# EAGLE design working (EAGLE 6.3)
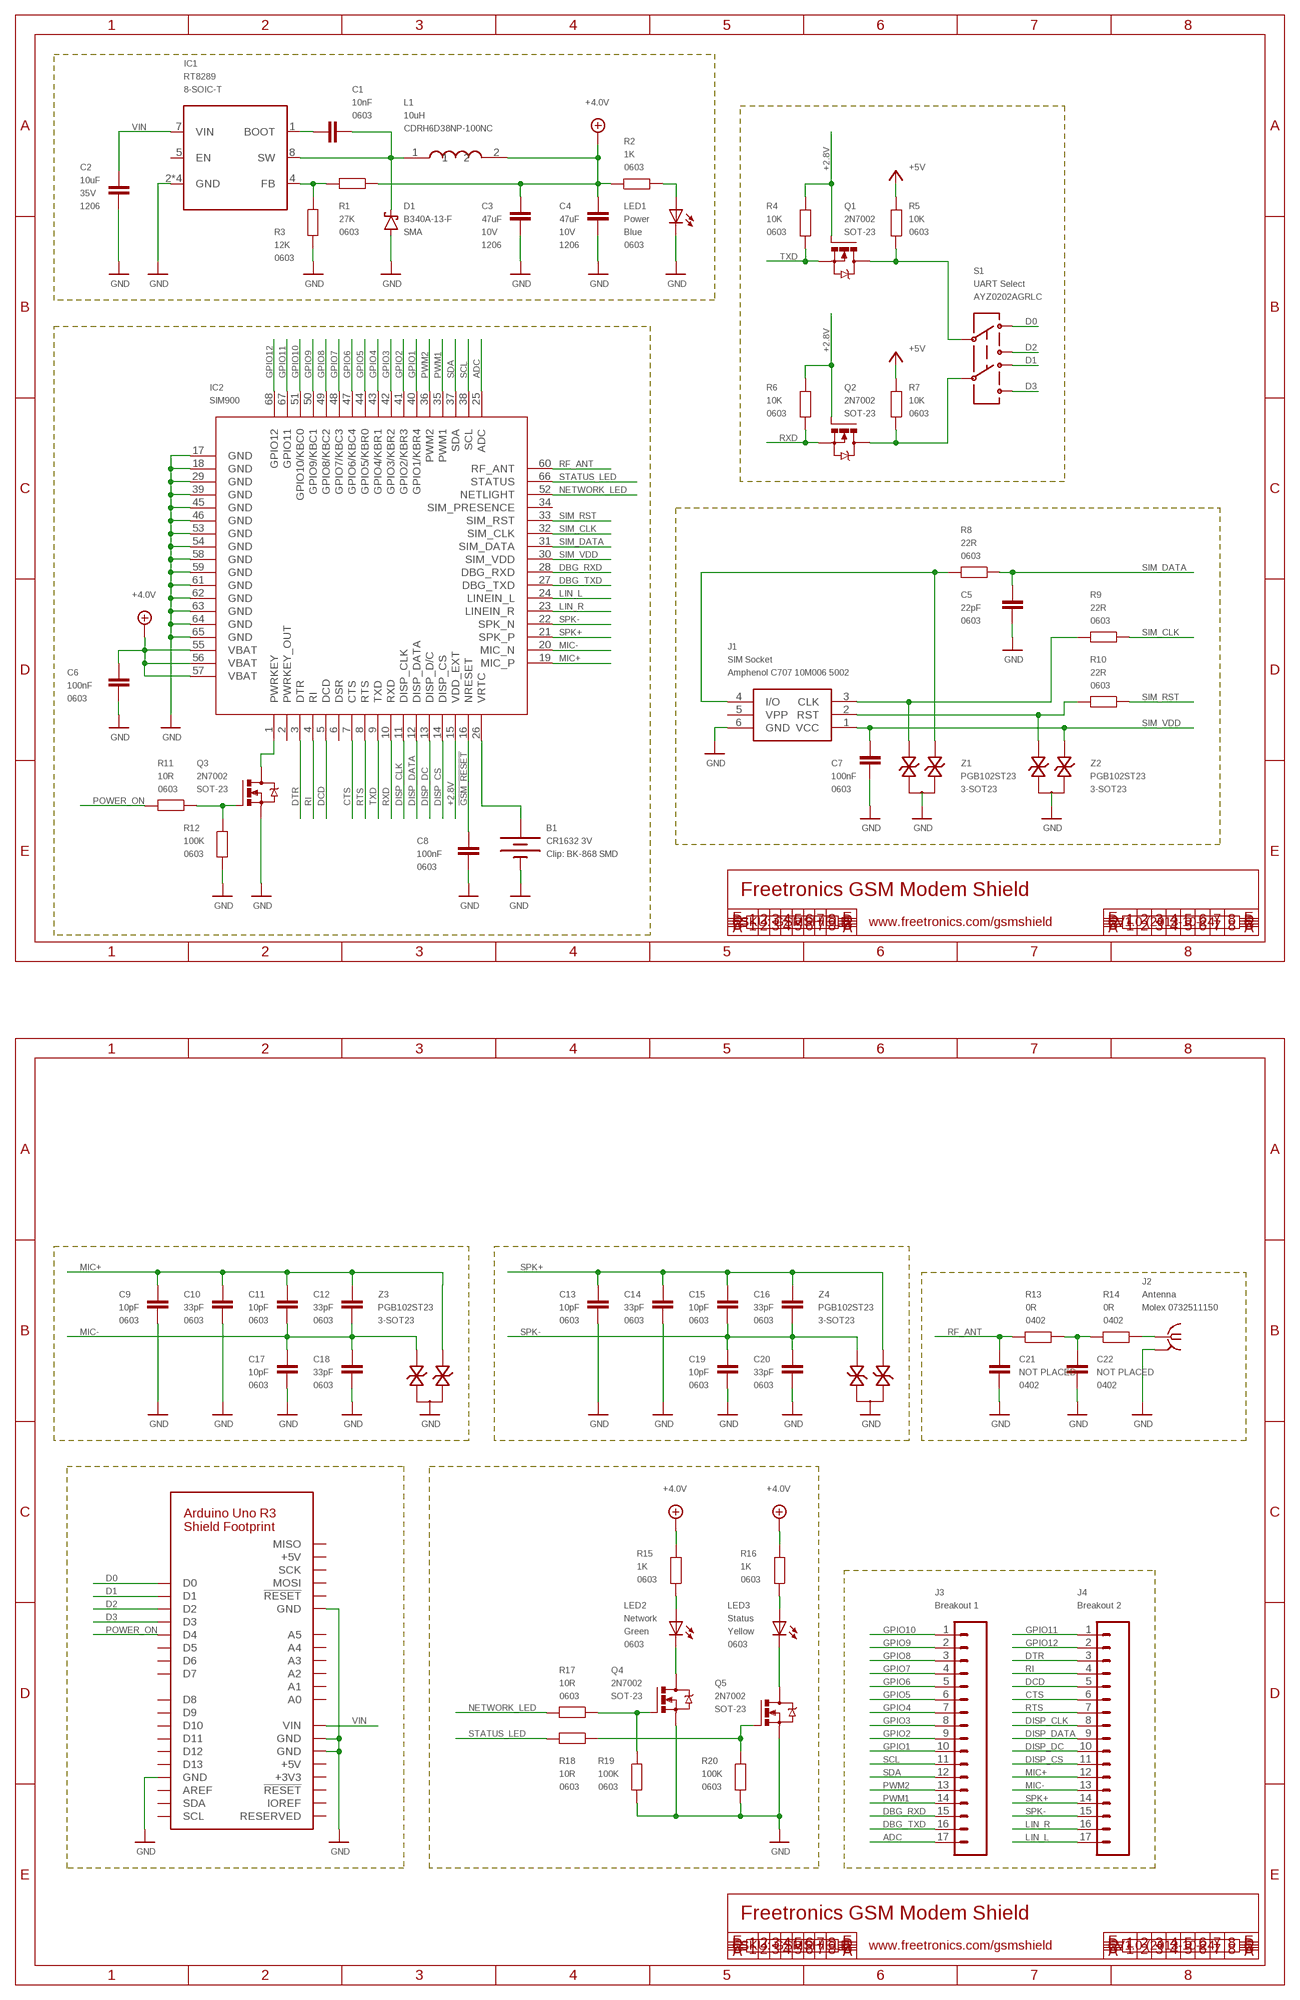
[diagram p0: schematic, sheet 1]

## Parts
B1  CR1632 3V  BATTERY  [BATCON_16MM]
C1  10nF  CAP0603  [0603]
C2  10uF  C-EUC1206  [C1206]
C3  47uF  C-EUC1206  [C1206]
C4  47uF  C-EUC1206  [C1206]
C5  22pF  CAP0603  [0603]
C6  100nF  CAP0603  [0603]
C7  100nF  CAP0603  [0603]
C8  100nF  CAP0603  [0603]
C9  10pF  CAP0603  [0603]
C10  33pF  CAP0603  [0603]
C11  10pF  CAP0603  [0603]
C12  33pF  CAP0603  [0603]
C13  10pF  CAP0603  [0603]
C14  33pF  CAP0603  [0603]
C15  10pF  CAP0603  [0603]
C16  33pF  CAP0603  [0603]
C17  10pF  CAP0603  [0603]
C18  33pF  CAP0603  [0603]
C19  10pF  CAP0603  [0603]
C20  33pF  CAP0603  [0603]
C21  NOT PLACED  CAP0402  [C0402]
C22  NOT PLACED  CAP0402  [C0402]
D1  B340A-13-F  SCHOTTKY-SMA  [SMA]
IC1  RT8289  [SO08T]
IC2  SIM900  [SIM900]
J1  SIM Socket  SIMHOLDER3  [SIMHOLDER3]
J2  Antenna  SMA-142-0701-881/886  [J502-ND-142-0701-881/886]
J3  Breakout 1  M17  [1X17]
J4  Breakout 2  M17  [1X17]
J5  ARDUINO-SHIELD_R3  [ARDUINO-SHIELD_R3]
L1  10uH  CDRH6D38SMT  [CDRH]
LED1  Power  LED0603  [LED-0603]
LED2  Network  LED0603  [LED-0603]
LED3  Status  LED0603  [LED-0603]
Q1  2N7002  [SOT23-3]
Q2  2N7002  [SOT23-3]
Q3  2N7002  [SOT23-3]
Q4  2N7002  [SOT23-3]
Q5  2N7002  [SOT23-3]
R1  27K  RESISTOR0603  [0603]
R2  1K  RESISTOR0603  [0603]
R3  12K  RESISTOR0603  [0603]
R4  10K  RESISTOR0603  [0603]
R5  10K  RESISTOR0603  [0603]
R6  10K  RESISTOR0603  [0603]
R7  10K  RESISTOR0603  [0603]
R8  22R  RESISTOR0603  [0603]
R9  22R  RESISTOR0603  [0603]
R10  22R  RESISTOR0603  [0603]
R11  10R  RESISTOR0603  [0603]
R12  100K  RESISTOR0603  [0603]
R13  0R  RESISTOR0402  [C0402]
R14  0R  RESISTOR0402  [C0402]
R15  1K  RESISTOR0603  [0603]
R16  1K  RESISTOR0603  [0603]
R17  10R  RESISTOR0603  [0603]
R18  10R  RESISTOR0603  [0603]
R19  100K  RESISTOR0603  [0603]
R20  100K  RESISTOR0603  [0603]
S1  UART Select  SWITCH-DPDTSMD  [AYZ0202]
Z1  PGB102ST23  [SOT23-3]
Z2  PGB102ST23  [SOT23-3]
Z3  PGB102ST23  [SOT23-3]
Z4  PGB102ST23  [SOT23-3]

## Nets
!GSM_RESET: C8.2 IC2.16(NRESET)
+2.8V: IC2.15(VDD_EXT) Q1.1(G) Q2.1(G) R4.1 R6.1
+4.0V: C3.1 C4.1 C6.2 IC2.55(VBAT) IC2.56(VBAT) IC2.57(VBAT) L1.2 R1.1 R2.1 R15.1 R16.1
+5V: R5.1 R7.1
ADC: IC2.25(ADC) J3.17
CTS: IC2.7(CTS) J4.6
D0: J5.D0 S1.1
D1: J5.D1 S1.4
D2: J5.D2 S1.3
D3: J5.D3 S1.6
DBG_RXD: IC2.28(DBG_RXD) J3.15
DBG_TXD: IC2.27(DBG_TXD) J3.16
DCD: IC2.5(DCD) J4.5
DISP_CLK: IC2.11(DISP_CLK) J4.8
DISP_CS: IC2.14(DISP_CS) J4.11
DISP_DATA: IC2.12(DISP_DATA) J4.9
DISP_DC: IC2.13(DISP_D/C) J4.10
DTR: IC2.3(DTR) J4.3
GND: B1.GND(-) C2.2 C3.2 C4.2 C5.1 C6.1 C7.1 C8.1 C9.1 C10.1 C13.1 C14.1 C17.1 C18.1 C19.1 C20.1 C21.1 C22.1 D1.A IC1.2(GND) IC1.3(GND) IC1.6(GND) IC1.PAD(GND) IC2.17(GND) IC2.18(GND) IC2.29(GND) IC2.39(GND) IC2.45(GND) IC2.46(GND) IC2.53(GND) IC2.54(GND) IC2.58(GND) IC2.59(GND) IC2.61(GND) IC2.62(GND) IC2.63(GND) IC2.64(GND) IC2.65(GND) J1.6(GND) J2.G@1(GND) J5.GND J5.GND@0(GND) J5.GND@1(GND) J5.GND@2(GND) LED1.C Q3.2(S) Q4.2(S) Q5.2(S) R3.1 R12.1 R19.1 R20.1 Z1.3 Z2.3 Z3.3 Z4.3
GPIO1: IC2.40(GPIO1/KBR4) J3.10
GPIO2: IC2.41(GPIO2/KBR3) J3.9
GPIO3: IC2.42(GPIO3/KBR2) J3.8
GPIO4: IC2.43(GPIO4/KBR1) J3.7
GPIO5: IC2.44(GPIO5/KBR0) J3.6
GPIO6: IC2.47(GPIO6/KBC4) J3.5
GPIO7: IC2.48(GPIO7/KBC3) J3.4
GPIO8: IC2.49(GPIO8/KBC2) J3.3
GPIO9: IC2.50(GPIO9/KBC1) J3.2
GPIO10: IC2.51(GPIO10/KBC0) J3.1
GPIO11: IC2.67(GPIO11) J4.1
GPIO12: IC2.68(GPIO12) J4.2
LIN_L: IC2.24(LINEIN_L) J4.17
LIN_R: IC2.23(LINEIN_R) J4.16
MIC+: C9.2 C10.2 C11.2 C12.2 IC2.19(MIC_P) J4.12 Z3.2
MIC-: C11.1 C12.1 C17.2 C18.2 IC2.20(MIC_N) J4.13 Z3.1
N$1: LED1.A R2.2
N$2: LED2.C Q4.3(D)
N$3: LED3.C Q5.3(D)
N$4: Q4.1(G) R17.1 R19.2
N$5: Q5.1(G) R18.1 R20.2
N$6: B1.PWR@1(+) IC2.26(VRTC)
N$22: J1.2(RST) R10.2 Z2.1
N$40: J1.3(CLK) R9.2 Z1.1
N$49: J1.4(I/O) R8.2 Z1.2
N$67: IC2.1(PWRKEY) Q3.3(D)
N$69: Q3.1(G) R11.1 R12.2
N$70: C22.2 R13.2 R14.1
N$71: J2.1 R14.2
N$76: LED3.A R16.2
N$77: LED2.A R15.2
N$143: C1.1 D1.K IC1.8(SW) L1.1
N$144: IC1.4(FB) R1.2 R3.2
N$145: C1.2 IC1.1(BOOT)
NETWORK_LED: IC2.52(NETLIGHT) R17.2
POWER_ON: J5.D4 R11.2
PWM1: IC2.35(PWM1) J3.14
PWM2: IC2.36(PWM2) J3.13
RF_ANT: C21.2 IC2.60(RF_ANT) R13.1
RI: IC2.4(RI) J4.4
RTS: IC2.8(RTS) J4.7
RXD: IC2.10(RXD) Q2.2(S) R6.2
RXD_5V: Q2.3(D) R7.2 S1.5
SCL: IC2.38(SCL) J3.11
SDA: IC2.37(SDA) J3.12
SIM_CLK: IC2.32(SIM_CLK) R9.1
SIM_DATA: C5.2 IC2.31(SIM_DATA) R8.1
SIM_RST: IC2.33(SIM_RST) R10.1
SIM_VDD: C7.2 IC2.30(SIM_VDD) J1.1(VCC) Z2.2
SPK+: C13.2 C14.2 C15.2 C16.2 IC2.21(SPK_P) J4.14 Z4.1
SPK-: C15.1 C16.1 C19.2 C20.2 IC2.22(SPK_N) J4.15 Z4.2
STATUS_LED: IC2.66(STATUS) R18.2
TXD: IC2.9(TXD) Q1.2(S) R4.2
TXD_5V: Q1.3(D) R5.2 S1.2
VIN: C2.1 IC1.7(VIN) J5.VIN
Unconnected: IC1.5(EN) IC2.2(PWRKEY_OUT) IC2.6(DSR) IC2.34(SIM_PRESENCE) J1.5(VPP) J5.!RESET J5.!RESET@0(!RESET) J5.+5V@0(+5V) J5.A0 J5.A1 J5.A2 J5.A3 J5.A4 J5.A5 J5.AREF J5.D5 J5.D6 J5.D7 J5.D8 J5.D9 J5.D10 J5.D11 J5.D12 J5.D13 J5.IOREF J5.MISO J5.MOSI J5.RESERVED J5.SCK J5.SCL J5.SDA

## Notes on the sheet
- Freetronics GSM Modem Shield
- SKU: GSMSHIELD | www.freetronics.com/gsmshield | V1.0 (2013-10-24)
- Freetronics GSM Modem Shield
- SKU: GSMSHIELD | www.freetronics.com/gsmshield | V1.0 (2013-10-24)

## Power pins joined to a net without a drawn wire
+3V3: J5.3V3(+3V3)
+5V: J5.+5V
GND: J2.G@2(GND) J2.G@3(GND) J2.G@4(GND)

## Library data of the parts
B1 = freetronics-master-v1:BATTERY: Battery Holders Various common sizes : AA, AAA, 20mm coin cell and 12mm coin cell.; FOO: Clip: BK-868 SMD
C1 C5-C20 = freetronics-master-v1:CAP: Capacitor Standard 0603 ceramic capacitor, and 0.1" leaded capacitor.; PACKAGE: 0603
C2 = rcl:C-EU: CAPACITOR, European symbol; PACKAGE: 1206; VOLTAGE: 35V
C3 C4 = rcl:C-EU: CAPACITOR, European symbol; PACKAGE: 1206; VOLTAGE: 10V
C21 C22 = freetronics-master-v1:CAP: Capacitor Standard 0603 ceramic capacitor, and 0.1" leaded capacitor.; PACKAGE: 0402
D1 = freetronics-luke:SCHOTTKY: Schottky diode; PACKAGE: SMA
IC1 = freetronics-luke:RT8289: RT8289 buck regulator; PACKAGE: 8-SOIC-T
IC2 = ICs_v54:SIM900
J1 = SparkFun2:SIMHOLDER3; ID: Amphenol C707 10M006 5002
J2 = con-coax:SMA-: SMA 50 Ohm End Launch Jack Receptacle - Round Contact Johnson Components Source: www.johnsoncomponents.com .. J502-ND.pdf; ID: Molex 0732511150; MF: JOHNSON COMPONENTS; MPN: 142-0701-881; OC_FARNELL: 1608603; OC_NEWARK: 08B906
J3 J4 = freetronics-master-v1:M17
J5 = freetronics-luke:ARDUINO-SHIELD_R3: Arduino Uno/Eleven/Leonardo shield, R3 compatible.
L1 = freetronics-jon:CDRH6D38: Inductor; ID: CDRH6D38NP-100NC
LED1 = freetronics-master-v1:LED: LEDs Standard schematic elements and footprints for 5mm, 3mm, 1206, and 0603 sized LEDs. 5mm - Spark Fun Electronics SKU : COM-00529 (and others); COLOR: Blue; PACKAGE: 0603
LED2 = freetronics-master-v1:LED: LEDs Standard schematic elements and footprints for 5mm, 3mm, 1206, and 0603 sized LEDs. 5mm - Spark Fun Electronics SKU : COM-00529 (and others); COLOR: Green; PACKAGE: 0603
LED3 = freetronics-master-v1:LED: LEDs Standard schematic elements and footprints for 5mm, 3mm, 1206, and 0603 sized LEDs. 5mm - Spark Fun Electronics SKU : COM-00529 (and others); COLOR: Yellow; PACKAGE: 0603
Q1-Q5 = freetronics-luke:2N7002: 2N7002 N-ch MOSFET in SOT-23.; PACKAGE: SOT-23
R1-R12 R15-R20 = freetronics-master-v1:RESISTOR: Resistor Basic schematic elements and footprints for 0603, 1206, and PTH 1/10th watt (small) resistors.; PACKAGE: 0603
R13 R14 = freetronics-master-v1:RESISTOR: Resistor Basic schematic elements and footprints for 0603, 1206, and PTH 1/10th watt (small) resistors.; PACKAGE: 0402
S1 = freetronics-master-v1:SWITCH-DPDT: DPDT Version of the COM-00597; ID: AYZ0202AGRLC
Z1-Z4 = freetronics-luke:PGB102ST23: Littelfuse PGB1 ESD transient suppressor in dual SOT-23 package. http://www.littelfuse.com/data/en/Data_Sheets/Littelfuse_PulseGuard-ESD_PGB1.pdf; PACKAGE: 3-SOT23

## Board
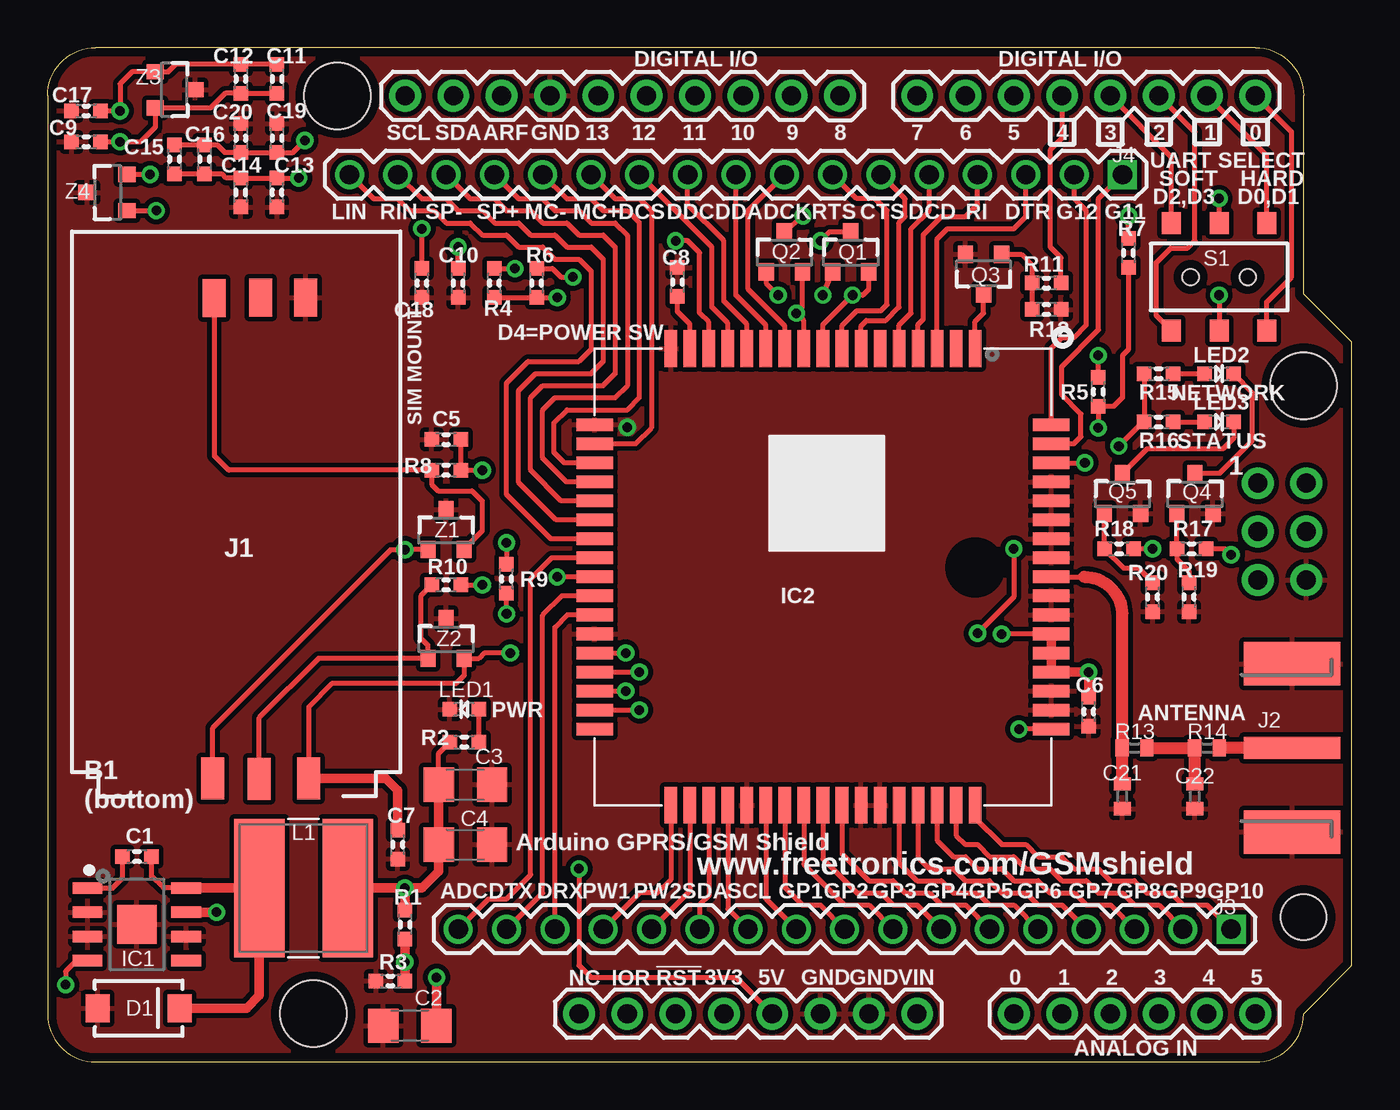
[diagram p1: board, top side]
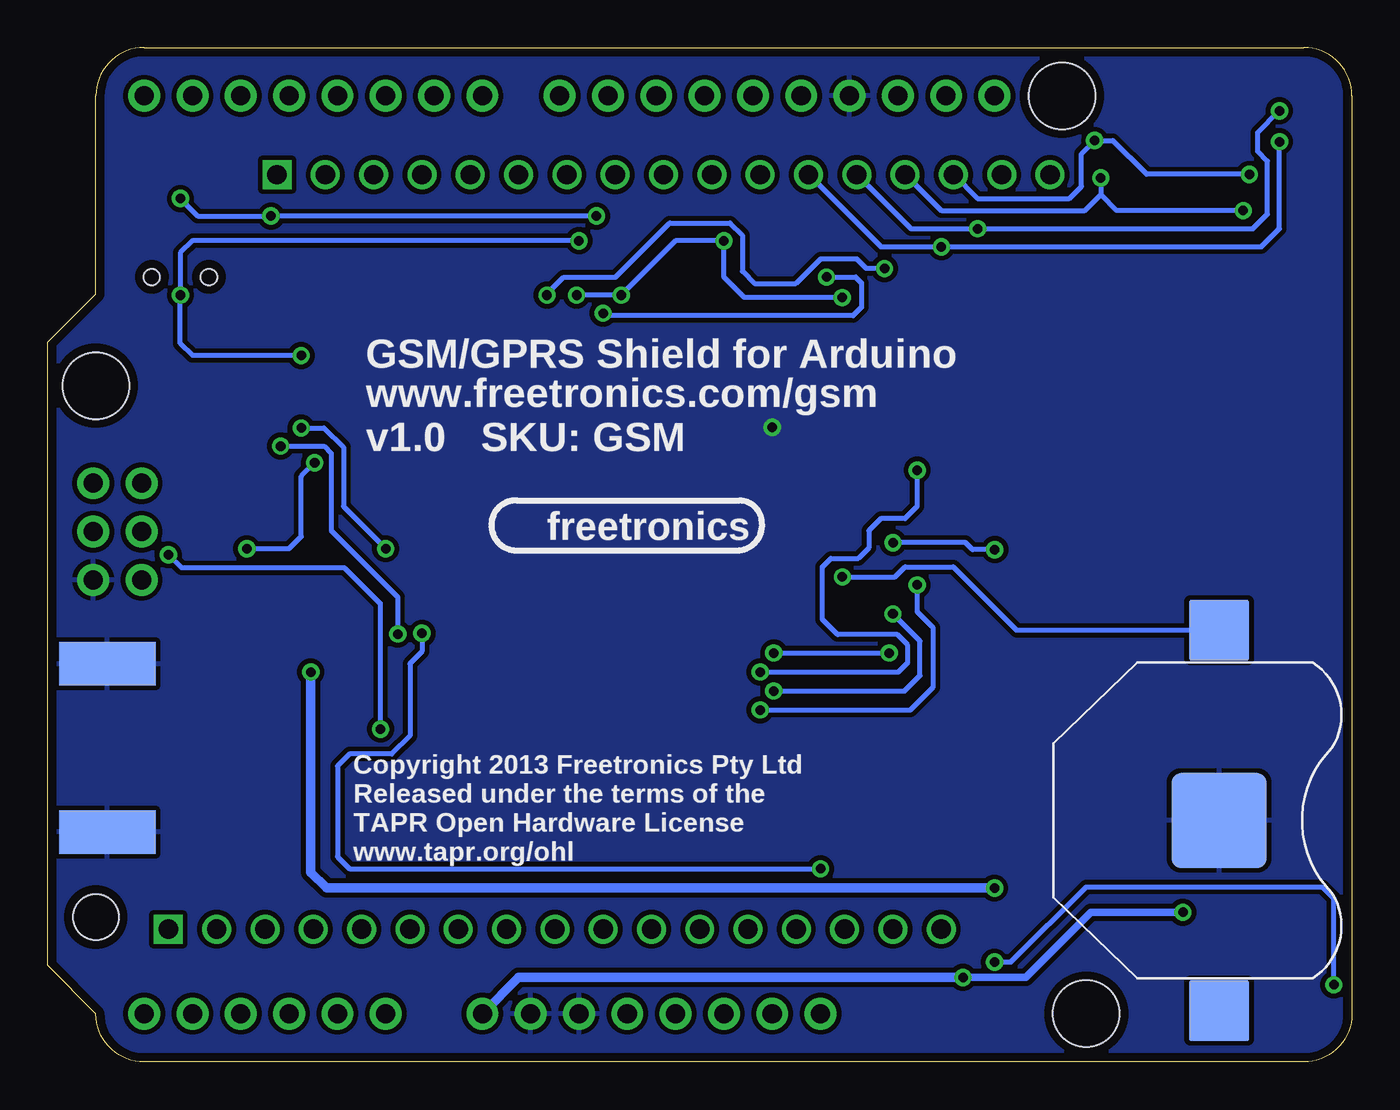
[diagram p2: board, bottom side, seen from below]

Size 68.58 x 53.34 mm. Coordinates in mm from the lower left corner, seen from the top.
Copper layers (1*16): Top 0.0356mm / dielectric 1.5011mm / Bottom 0.0356mm
Design rules "LaenPCBOrder *": minimum track width 10mil, minimum drill 18mil, track to track 10mil, track to pad 10mil, pad to pad 10mil, via to via 10mil, smd to smd 8mil, copper to edge 18mil, drill to drill 8mil, minimum pad ring 10mil, minimum via ring 8mil, stop-mask expansion 4mil, vias tented up to drill 25mil, thermal gap 10mil

### Footprints (pad centres in the part's own frame; a part is rotated, then mirrored left to right if it is on the bottom)
BATCON_16MM = smd 5 x 5: GND 0,0 | smd 3.175 x 3.175: PWR@1 -10,0; PWR@2 10,0
0603 = smd 0.762 x 0.762: 1 -0.762,0; 2 0.762,0
C1206 = smd 1.6 x 1.8: 1 -1.4,0; 2 1.4,0
C0402 = smd 0.7 x 0.9: 1 -0.65,0; 2 0.65,0
SMA = smd 1.27 x 1.47: A -2.15,0; K 2.15,0
SO08T = smd 0.6 x 1.575: 1 -1.905,-2.6; 2 -0.635,-2.6; 3 0.635,-2.6; 4 1.905,-2.6; 5 1.905,2.6; 6 0.635,2.6; 7 -0.635,2.6; 8 -1.905,2.6 | smd 2.057 x 2.057: PAD 0,0
SIM900 = smd 1.93 x 0.66: 1 -12,8; 2 -12,7; 3 -12,6; 4 -12,5; 5 -12,4; 6 -12,3; 7 -12,2; 8 -12,1; 9 -12,0; 10 -12,-1; 11 -12,-2; 12 -12,-3; 13 -12,-4; 14 -12,-5; 15 -12,-6; 16 -12,-7; 17 -12,-8; 35 12,-8; 36 12,-7; 37 12,-6; 38 12,-5; 39 12,-4; 40 12,-3; 41 12,-2; 42 12,-1; 43 12,0; 44 12,1; 45 12,2; 46 12,3; 47 12,4; 48 12,5; 49 12,6; 50 12,7; 51 12,8 | smd 0.66 x 1.93: 18 -8,-12; 19 -7,-12; 20 -6,-12; 21 -5,-12; 22 -4,-12; 23 -3,-12; 24 -2,-12; 25 -1,-12; 26 0,-12; 27 1,-12; 28 2,-12; 29 3,-12; 30 4,-12; 31 5,-12; 32 6,-12; 33 7,-12; 34 8,-12; 52 8,12; 53 7,12; 54 6,12; 55 5,12; 56 4,12; 57 3,12; 58 2,12; 59 1,12; 60 0,12; 61 -1,12; 62 -2,12; 63 -3,12; 64 -4,12; 65 -5,12; 66 -6,12; 67 -7,12; 68 -8,12
SIMHOLDER3 = smd 2.2 x 1.2: 1 0.95,4.81; 2 0.91,7.41; 3 0.95,9.86 | smd 2 x 1.2: 4 26.2,9.78; 5 26.22,7.34; 6 26.22,4.98
J502-ND-142-0701-881/886 = smd 5.08 x 1.143: 1 2.565,0 | smd 5.08 x 2.286: G@1 2.565,4.42; G@2 2.565,-4.42 | smd 5.08 x 2.286 bottom: G@3 2.565,4.42; G@4 2.565,-4.42
1X17 = drill 1.016 square: 1 0,0 | drill 1.016: 2 2.54,0; 3 5.08,0; 4 7.62,0; 5 10.16,0; 6 12.7,0; 7 15.24,0; 8 17.78,0; 9 20.32,0; 10 22.86,0; 11 25.4,0; 12 27.94,0; 13 30.48,0; 14 33.02,0; 15 35.56,0; 16 38.1,0; 17 40.64,0
ARDUINO-SHIELD_R3 = drill 1 pad 1.676: 3V3 0,-24.13; !RESET -2.54,-24.13; !RESET@0 28.08,-1.32; +5V 2.54,-24.13; +5V@0 30.62,3.76; A0 15.24,-24.13; A1 17.78,-24.13; A2 20.32,-24.13; A3 22.86,-24.13; A4 25.4,-24.13; A5 27.94,-24.13; AREF -11.684,24.13; D0 27.94,24.13; D1 25.4,24.13; D2 22.86,24.13; D3 20.32,24.13; D4 17.78,24.13; D5 15.24,24.13; D6 12.7,24.13; D7 10.16,24.13; D8 6.096,24.13; D9 3.556,24.13; D10 1.016,24.13; D11 -1.524,24.13; D12 -4.064,24.13; D13 -6.604,24.13; GND 7.62,-24.13; GND@0 5.08,-24.13; GND@1 -9.144,24.13; GND@2 30.62,-1.32; IOREF -5.08,-24.13; MISO 28.08,3.76; MOSI 30.62,1.22; RESERVED -7.62,-24.13; SCK 28.08,1.22; SCL -16.764,24.13; SDA -14.224,24.13; VIN 10.16,-24.13 | hole 3.5: 30.48,8.89; -20.32,24.13; -21.59,-24.13 | hole 2.4: 30.48,-19.05
CDRH = smd 7.3 x 2.65: 1 0,2.325; 2 0,-2.325
LED-0603 = smd 0.762 x 0.762: A -0.762,0; C 0.762,0
SOT23-3 = smd 0.8 x 0.9: 1 -0.95,-1; 2 0.95,-1; 3 0,1.1
AYZ0202 = smd 1 x 1.15: 1 -2.5,2.825; 2 0,2.825; 3 2.5,2.825; 4 -2.5,-2.825; 5 0,-2.825; 6 2.5,-2.825 | hole 0.85: 1.5,0; -1.5,0

### Placement (x,y rotation side)
B1  6.99,12.7 270 bottom
C1  4.7,10.8 180 top
C2  19.05,1.91 180 top
C3  21.97,14.59 0 top
C4  21.97,11.43 0 top
C5  20.96,32.73 0 top
C6  54.74,18.42 90 top
C7  18.42,11.43 90 top
C8  33.11,41.01 270 top
C9  2.03,48.39 0 top
C10  21.59,40.96 90 top
C11  12.07,51.69 270 top
C12  10.16,51.69 270 top
C13  12.07,45.72 90 top
C14  10.16,45.72 90 top
C15  6.67,47.47 270 top
C16  8.26,47.47 270 top
C17  2.03,50.01 0 top
C18  19.69,40.96 90 top
C19  12.07,48.58 270 top
C20  10.16,48.58 270 top
C21  56.5,13.97 90 top
C22  60.31,13.97 90 top
D1  4.79,2.83 0 top
IC1  4.7,7.24 270 top
IC2  40.77,25.5 270 top
J1  18.54,13.97 90 top
J2  62.87,16.51 0 top
J3  62.23,6.99 180 top
J4  56.52,46.66 180 top
J5  35.56,26.67 0 top
L1  13.46,9.14 90 top
LED1  21.91,18.54 180 top
LED2  61.59,36.2 0 top
LED3  61.59,33.66 0 top
Q1  42.23,42.55 0 top
Q2  38.73,42.55 0 top
Q3  49.21,41.47 180 top
Q4  60.33,29.85 0 top
Q5  56.52,29.85 0 top
R1  18.79,7.23 270 top
R2  21.91,16.83 0 top
R3  18.03,4.26 0 top
R4  23.5,40.96 90 top
R5  55.25,35.24 90 top
R6  25.72,40.96 90 top
R7  56.83,42.55 90 top
R8  20.96,31.12 180 top
R9  24.13,25.4 90 top
R10  20.96,25.08 180 top
R11  52.51,40.96 0 top
R12  52.51,39.56 180 top
R13  57.15,16.51 0 top
R14  60.96,16.51 0 top
R15  58.42,36.2 0 top
R16  58.42,33.66 0 top
R17  60.14,26.99 0 top
R18  56.33,26.99 0 top
R19  60.01,24.45 90 top
R20  58.1,24.45 90 top
S1  61.59,41.27 180 top
Z1  20.96,27.94 0 top
Z2  20.96,22.23 0 top
Z3  6.67,51.12 270 top
Z4  3.18,45.72 90 top

### Tracks (layer width: path | path; a pad name or v marks a point on that pad's centre or on a via)
!GSM_RESET
  Top 0.254: IC2.16 33.77,38.81 33.11,39.46 C8.2
+2.8V  (via drill 0.5)
  Top 0.254: IC2.15 34.77,38.89 34.29,39.37 34.29,42.55 33.66,43.18 v33.02,43.18 | Q2.1 37.79,40.96 v38.42,40.32 | v40.77,40.32 Q1.1 | R4.1 R6.1 v26.8,40.2
  Bottom 0.254: v40.77,40.32 v38.42,40.32 35.56,43.18 v33.02,43.18 33.02,41.27 31.94,40.2 v26.8,40.2
+4.0V  (via drill 0.5)
  Top 0.254: R2.1 21.15,16.8 20.57,16.23 C3.1 | R15.1 R16.1 57.59,33.66 v56.32,32.39 | IC2.57 v50.16,22.51
  Top 0.508: IC2.57 IC2.56 IC2.55 v54.74,20.51 C6.2 | L1.2 v18.79,9.14 | v18.79,9.14 19.69,9.14 20.57,10.03 C4.1 C3.1 | v18.79,9.14 R1.1
  Bottom 0.254: v56.32,32.39 54.04,32.39 53.66,32 53.66,27.94 50.16,24.45 v50.16,22.51
  Bottom 0.508: v18.79,9.14 53.91,9.14 54.74,9.97 v54.74,20.51
+5V  (via drill 0.5)
  Top 0.254: v50.8,26.99 50.8,24.45 v48.9,22.54 | v27.94,10.16 27.94,5.08 28.58,4.45 36.2,4.45 J5.+5V | v55.25,33.34 R5.1 56.07,34.48 56.52,34.93 56.52,37.15 56.83,37.47 R7.1
  Bottom 0.254: v55.25,33.34 54.04,33.34 53.02,32.32 53.02,29.21 v50.8,26.99 | v27.94,10.16 52.71,10.16 53.34,10.8 53.34,15.56 52.71,16.19 50.48,16.19 49.53,17.15 49.53,20.96 48.9,21.59 v48.9,22.54
ADC
  Top 0.254: J3.17 23.18,8.57 24.13,8.57 25.4,9.84 25.4,25.4 26.51,26.51 IC2.25
CTS
  Top 0.254: J4.6 45.09,45.39 45.09,44.45 44.77,44.13 44.77,39.69 44.07,38.99 43.05,38.99 42.77,38.7 IC2.7
D0
  Top 0.254: S1.1 64.09,39.97 65.41,41.27 65.41,48.9 J5.D0
D1
  Top 0.254: J5.D1 64.09,47.66 S1.4
D2
  Top 0.254: J5.D2 60.33,48.9 60.33,43.18 59.94,42.8 59.05,42.8 58.29,42.04 58.29,39.25 S1.3
D3
  Top 0.254: S1.6 59.09,47.59 J5.D3
DBG_RXD
  Top 0.254: J3.15 26.67,22.86 27.32,23.51 IC2.28
DBG_TXD
  Top 0.254: J3.16 26.04,8.89 26.04,23.5 27.05,24.51 IC2.27
DCD
  Top 0.254: IC2.5 44.77,38.73 45.4,39.37 45.4,43.82 46.36,44.77 J4.5
DISP_CLK
  Top 0.254: IC2.11 38.77,38.7 36.83,40.64 36.83,44.75 J4.8
DISP_CS
  Top 0.254: J4.11 34.93,42.85 34.93,39.69 35.77,38.84 IC2.14
DISP_DATA
  Top 0.254: IC2.12 37.77,38.75 36.2,40.32 J4.9
DISP_DC
  Top 0.254: IC2.13 36.77,38.8 35.56,40.01 35.56,43.18 33.66,45.09 J4.10
DTR
  Top 0.254: J4.3 51.44,44.45 50.8,43.82 47.31,43.82 46.77,43.27 IC2.3
GND  (via drill 0.5)
  other vias: 30.48,33.38
  pour Top (isolate 0.254): -0.32,53.66 68.9,53.66 68.9,-0.32 -0.32,-0.32
  pour Bottom (isolate 0.254): -0.32,53.66 68.9,53.66 68.9,-0.32 -0.32,-0.32
GPIO1
  Top 0.254: IC2.40 37.77,8.59 J3.10
GPIO2
  Top 0.254: J3.9 40.64,8.26 39.69,8.26 38.77,9.18 IC2.41
GPIO3
  Top 0.254: IC2.42 39.77,10.4 41.91,8.26 43.18,8.26 J3.8
GPIO4
  Top 0.254: IC2.43 40.77,10.67 42.55,8.89 43.82,8.89 44.45,8.26 45.72,8.26 J3.7
GPIO5
  Top 0.254: IC2.44 41.77,10.94 43.18,9.53 44.45,9.53 45.09,8.89 46.36,8.89 46.99,8.26 48.26,8.26 J3.6
GPIO6
  Top 0.254: IC2.47 44.77,10.48 45.72,9.53 46.99,9.53 47.62,8.89 48.9,8.89 49.53,8.26 50.8,8.26 J3.5
GPIO7
  Top 0.254: IC2.48 45.77,10.75 46.36,10.16 47.62,10.16 48.26,9.53 49.53,9.53 50.16,8.89 51.44,8.89 52.07,8.26 53.34,8.26 J3.4
GPIO8
  Top 0.254: IC2.49 46.77,11.65 47.62,10.8 48.26,10.8 48.9,10.16 50.16,10.16 50.8,9.53 52.07,9.53 52.71,8.89 53.98,8.89 54.61,8.26 55.88,8.26 J3.3
GPIO9
  Top 0.254: IC2.50 47.77,11.92 48.26,11.43 48.9,11.43 49.53,10.8 50.8,10.8 51.44,10.16 52.71,10.16 53.34,9.53 54.61,9.53 55.25,8.89 56.52,8.89 57.15,8.26 58.42,8.26 J3.2
GPIO10
  Top 0.254: IC2.51 48.77,12.83 50.16,11.43 51.44,11.43 52.07,10.8 53.34,10.8 53.98,10.16 55.25,10.16 55.88,9.53 57.15,9.53 57.79,8.89 59.05,8.89 59.69,8.26 60.96,8.26 J3.1
GPIO11
  Top 0.254: IC2.67 53.96,32.51 54.33,32.88 54.33,34.08 53.32,35.09 53.32,36.56 55.26,38.5 55.26,45.4 J4.1
GPIO12
  Top 0.254: J4.2 53.98,45.4 54.61,44.77 54.61,38.73 53.98,38.1 53.34,38.1 52.77,37.53 IC2.68
LIN_L
  Top 0.254: IC2.24 26.47,27.51 24.13,29.85 24.13,35.69 25.27,36.83 27.94,36.83 28.58,37.47 28.58,41.58 27.94,42.21 26.67,42.21 26.04,42.85 24.77,42.85 24.13,43.48 22.86,43.48 22.23,44.12 20.96,44.12 20.32,44.75 19.05,44.75 18.42,45.39 17.15,45.39 J4.17
LIN_R
  Top 0.254: IC2.23 26.74,28.51 24.77,30.48 24.77,35.31 25.65,36.2 28.58,36.2 29.21,36.83 29.21,42.21 28.58,42.85 27.31,42.85 26.67,43.48 25.4,43.48 24.77,44.12 23.5,44.12 22.86,44.75 21.59,44.75 20.96,45.39 19.69,45.39 J4.16
MIC+  (via drill 0.5)
  Top 0.254: IC2.19 30.92,32.51 31.75,33.34 31.75,44.75 31.12,45.39 29.85,45.39 J4.12 | C9.2 v3.81,48.39 4.89,48.39 5.67,49.16 Z3.2 8.58,50.17 9.34,50.93 C12.2 C11.2 | C10.2 v21.59,42.86
  Bottom 0.254: J4.12 28.56,46.66 24.77,42.86 v21.59,42.86 4.76,42.86 3.81,43.82 v3.81,48.39
MIC-  (via drill 0.5)
  Top 0.254: IC2.20 27.18,31.51 26.63,32.05 26.63,33.61 27.31,34.29 30.48,34.29 31.12,34.93 31.12,44.12 30.48,44.75 29.21,44.75 28.58,45.39 27.31,45.39 J4.13 | C17.2 v3.81,50.01 3.81,51.44 4.44,52.07 Z3.1 6.35,52.07 6.73,52.45 C12.1 C11.1 | C18.2 v19.69,43.82
  Bottom 0.254: J4.13 26.02,46.66 23.18,43.82 v19.69,43.82 5.21,43.82 4.45,44.58 4.45,47.37 4.95,47.88 4.95,48.87 v3.81,50.01
N$1
  Top 0.254: LED1.A R2.2
N$2
  Top 0.254: LED2.C 62.36,36.17 63.32,35.21 63.32,32.66 61.61,30.95 Q4.3
N$3
  Top 0.254: LED3.C 62.36,32.8 61.79,32.24 57.81,32.24 Q5.3
N$4
  Top 0.254: Q4.1 R17.1 59.38,26.44 60.01,25.81 R19.2
N$5
  Top 0.254: Q5.1 R18.1 56.58,25.97 57.34,25.97 R20.2
N$6  (via drill 0.5 pad 0.61)
  Top 0.254: IC2.26 v26.79,25.51
  Bottom 0.254: v26.79,25.51 24.03,25.51 23.5,26.04 20.96,26.04 17.62,22.7 B1.PWR@1
N$22
  Top 0.254: J1.2 11.13,18.12 14.24,21.23 Z2.1 20.01,21.91 19.62,22.29 19.62,24.5 20.19,25.07 R10.2
N$40  (via drill 0.5)
  Top 0.254: J1.3 8.68,17.57 18.05,26.94 v18.78,26.94 Z1.1 | v24.13,27.31 R9.2
  Bottom 0.254: v18.78,26.94 19.96,26.94 20.32,27.31 v24.13,27.31
N$49
  Top 0.254: Z1.2 21.91,26.99 22.86,27.94 22.86,29.47 22.31,30.03 20.54,30.03 20.19,30.38 R8.2 9.53,31.12 8.76,31.88 J1.4
N$67
  Top 0.254: IC2.1 48.77,38.92 49.21,39.37 Q3.3
N$69
  Top 0.254: Q3.1 51.2,42.47 51.75,41.91 R11.1 R12.2
N$70
  Top 0.254: R14.1
  Top 0.635: R13.2 R14.1 C22.2
N$71
  Top 0.254: 67.31,16.51 J2.1 64.13,16.51
  Top 0.635: 64.13,16.51 R14.2
N$76
  Top 0.254: R16.2 LED3.A
N$77
  Top 0.254: R15.2 LED2.A
N$143
  Top 0.254: IC1.8 6.1,9.14 5.46,9.78 C1.1
  Top 0.508: IC1.8 L1.1 11.14,3.5 10.47,2.83 D1.K
N$144  (via drill 0.5)
  Top 0.254: IC1.4 1.52,5.33 0.95,4.76 v0.95,4.06
  Top 0.508: R1.2 v18.79,5.26 R3.2
  Bottom 0.254: v18.79,5.26 17.92,5.26 13.97,9.21 1.57,9.21 0.95,8.6 v0.95,4.06
N$145
  Top 0.254: IC1.1 3.44,9.14 3.94,9.65 C1.2
NETWORK_LED  (via drill 0.5)
  Top 0.254: IC2.52 v51.08,17.51 | R17.2 61.91,26.99 v62.23,26.67
  Bottom 0.254: v51.08,17.51 51.08,24.09 52.96,25.98 61.54,25.98 v62.23,26.67
POWER_ON
  Top 0.254: J5.D4 53.34,48.58 52.71,47.94 52.71,42.86 53.28,42.29 R11.2
PWM1
  Top 0.254: IC2.35 32.77,9.59 32.07,8.89 31.12,8.89 J3.14
PWM2
  Top 0.254: IC2.36 33.77,9 J3.13
RF_ANT
  Top 0.254: IC2.60 54.51,25.51 | R13.1
  Top 0.635: C21.2 R13.1 56.5,23.51 arc90 54.51,25.51
RI
  Top 0.254: IC2.4 45.77,38.78 46.04,39.05 46.04,43.5 46.99,44.45 48.26,44.45 48.9,45.09 J4.4
RTS
  Top 0.254: J4.7 42.53,45.4 43.5,45.4 44.13,44.77 44.13,39.82 43.82,39.5 42.55,39.5 41.77,38.72 IC2.8
RXD  (via drill 0.5)
  Top 0.254: 39.69,41.53 Q2.2 39.69,39.69 v39.37,39.37 39.77,38.97 IC2.10 | R6.2 26.54,41.72 26.99,41.27 v27.62,41.27
  Bottom 0.254: v27.62,41.27 26.1,41.27 25.78,40.96 25.78,39.69 26.23,39.24 39.24,39.24 v39.37,39.37
RXD_5V  (via drill 0.5)
  Top 0.254: Q2.3 38.73,43.69 v39.72,44.48 | S1.5 v61.59,45.4 | R7.2 v56.83,44.48
  Bottom 0.254: v39.72,44.48 v56.83,44.48 60.67,44.48 v61.59,45.4
SCL
  Top 0.254: IC2.38 35.77,8.05 J3.11
SDA
  Top 0.254: IC2.37 34.77,8.73 34.29,8.26 J3.12
SIM_CLK  (via drill 0.5)
  Top 0.254: IC2.32 v30.4,19.51 | v24.13,23.56 R9.1
  Bottom 0.254: v30.4,19.51 23.52,19.51 22.7,20.32 22.7,22.13 v24.13,23.56
SIM_DATA  (via drill 0.5)
  Top 0.254: IC2.31 v31.12,20.51 | v22.86,31.12 R8.1 C5.2
  Bottom 0.254: v31.12,20.51 23.85,20.51 23.35,21 23.35,21.92 23.9,22.48 27.05,22.48 27.85,23.28 27.85,26.04 27.4,26.49 25.95,26.49 25.4,27.04 25.4,27.94 24.77,28.58 23.5,28.58 22.86,29.21 v22.86,31.12
SIM_RST  (via drill 0.5)
  Top 0.254: R10.1 v22.86,25.08 | IC2.33 v31.12,18.51
  Bottom 0.254: v31.12,18.51 23.22,18.51 22.03,19.69 22.03,22.86 22.86,23.69 v22.86,25.08
SIM_VDD  (via drill 0.5)
  Top 0.254: IC2.30 v30.4,21.51 | J1.1 13.73,18.68 14.95,19.9 21.47,19.9 21.91,20.33 Z2.2 22.68,21.23 22.96,21.51 v24.34,21.51
  Top 0.508: J1.1 17.78,14.92 18.42,14.29 C7.2
  Bottom 0.254: v30.4,21.51 v24.34,21.51
SPK+  (via drill 0.5)
  Top 0.254: IC2.21 27.28,30.51 26.04,31.75 26.04,34.29 26.67,34.93 29.85,34.93 30.48,35.56 30.48,43.48 29.85,44.12 28.58,44.12 27.94,44.75 26.67,44.75 26.04,45.39 24.77,45.39 J4.14 | v13.21,46.48 C13.2 C14.2 9.4,46.48 9.18,46.7 C16.2 C15.2 | Z4.1 v5.72,44.77
  Bottom 0.254: J4.14 23.48,46.66 21.59,44.77 14.03,44.77 13.21,45.59 | v5.72,44.77 12.39,44.77 13.21,45.59 | v13.21,46.48 13.21,45.59
SPK-  (via drill 0.5)
  Top 0.254: IC2.22 27.01,29.51 25.4,31.12 25.4,34.93 26.04,35.56 29.21,35.56 29.85,36.2 29.85,42.85 29.21,43.48 27.94,43.48 27.31,44.12 26.04,44.12 25.4,44.75 24.13,44.75 23.5,45.39 22.23,45.39 J4.15 | C15.1 C16.1 8.92,48.23 9.34,47.82 C20.2 C19.2 12.89,47.82 v13.53,48.45 | Z4.2 v5.4,46.67
  Bottom 0.254: J4.15 20.94,46.66 19.69,45.4 14.86,45.4 14.22,46.04 14.22,47.75 v13.53,48.45 12.57,48.45 10.79,46.67 v5.4,46.67
STATUS_LED  (via drill 0.5)
  Top 0.254: R18.2 v58.1,26.99 | IC2.66 v54.54,31.51
  Bottom 0.254: v58.1,26.99 55.88,26.99 55.25,27.62 55.25,30.8 v54.54,31.51
TXD  (via drill 0.5)
  Top 0.254: IC2.9 40.77,38.77 v42.32,40.32 42.86,40.32 43.18,40.64 Q1.2 | R4.2 v24.57,41.72
  Bottom 0.254: v42.32,40.32 42.36,40.32 42.36,40.34 41.44,41.26 38.72,41.26 35.87,44.11 32.7,44.11 32.05,43.47 32.05,41.58 31.41,40.93 29.24,40.93 27.94,42.23 26.04,42.23 25.53,41.72 v24.57,41.72
TXD_5V  (via drill 0.5)
  Top 0.254: Q1.3 41.11,43.65 v40.64,43.18 | v61.59,40.32 S1.2 | R5.2 v55.25,37.15
  Bottom 0.254: v40.64,43.18 60.96,43.18 61.59,42.55 v61.59,40.32 61.59,37.78 60.96,37.15 v55.25,37.15
VIN  (via drill 0.5)
  Top 0.508: IC1.7 v8.89,7.87 | C2.1 v20.45,4.45
  Bottom 0.406: v20.45,4.45 17.15,4.45 13.72,7.87 v8.89,7.87
  Bottom 0.508: v20.45,4.45 43.82,4.45 J5.VIN

### Text on the board
tPlace: UART SELECT | SOFT | HARD | D2,D3 | D0,D1 | LIN | RIN | SP- | SP+ | MC- | MC+ | DCS | DDC | DDA | DCK | RTS | CTS | DCD | RI | DTR | G12 | G11 | D4=POWER SW | NETWORK | SIM MOUNT | STATUS | 1 | PWR | ANTENNA | Arduino GPRS/GSM Shield | www.freetronics.com/GSMshield | ADC | DTX | DRX | PW1 | PW2 | SDA | SCL | GP1 | GP2 | GP3 | GP4 | GP5 | GP6 | GP7 | GP8 | GP9 | GP10
bPlace: GSM/GPRS Shield for Arduino | www.freetronics.com/gsm | v1.0 SKU: GSM | freetronics | Copyright 2013 Freetronics Pty Ltd / Released under the terms of the / TAPR Open Hardware License / www.tapr.org/ohl
tNames: J1 | B1 / (bottom)
tDocu: A | K | A | K | A | K